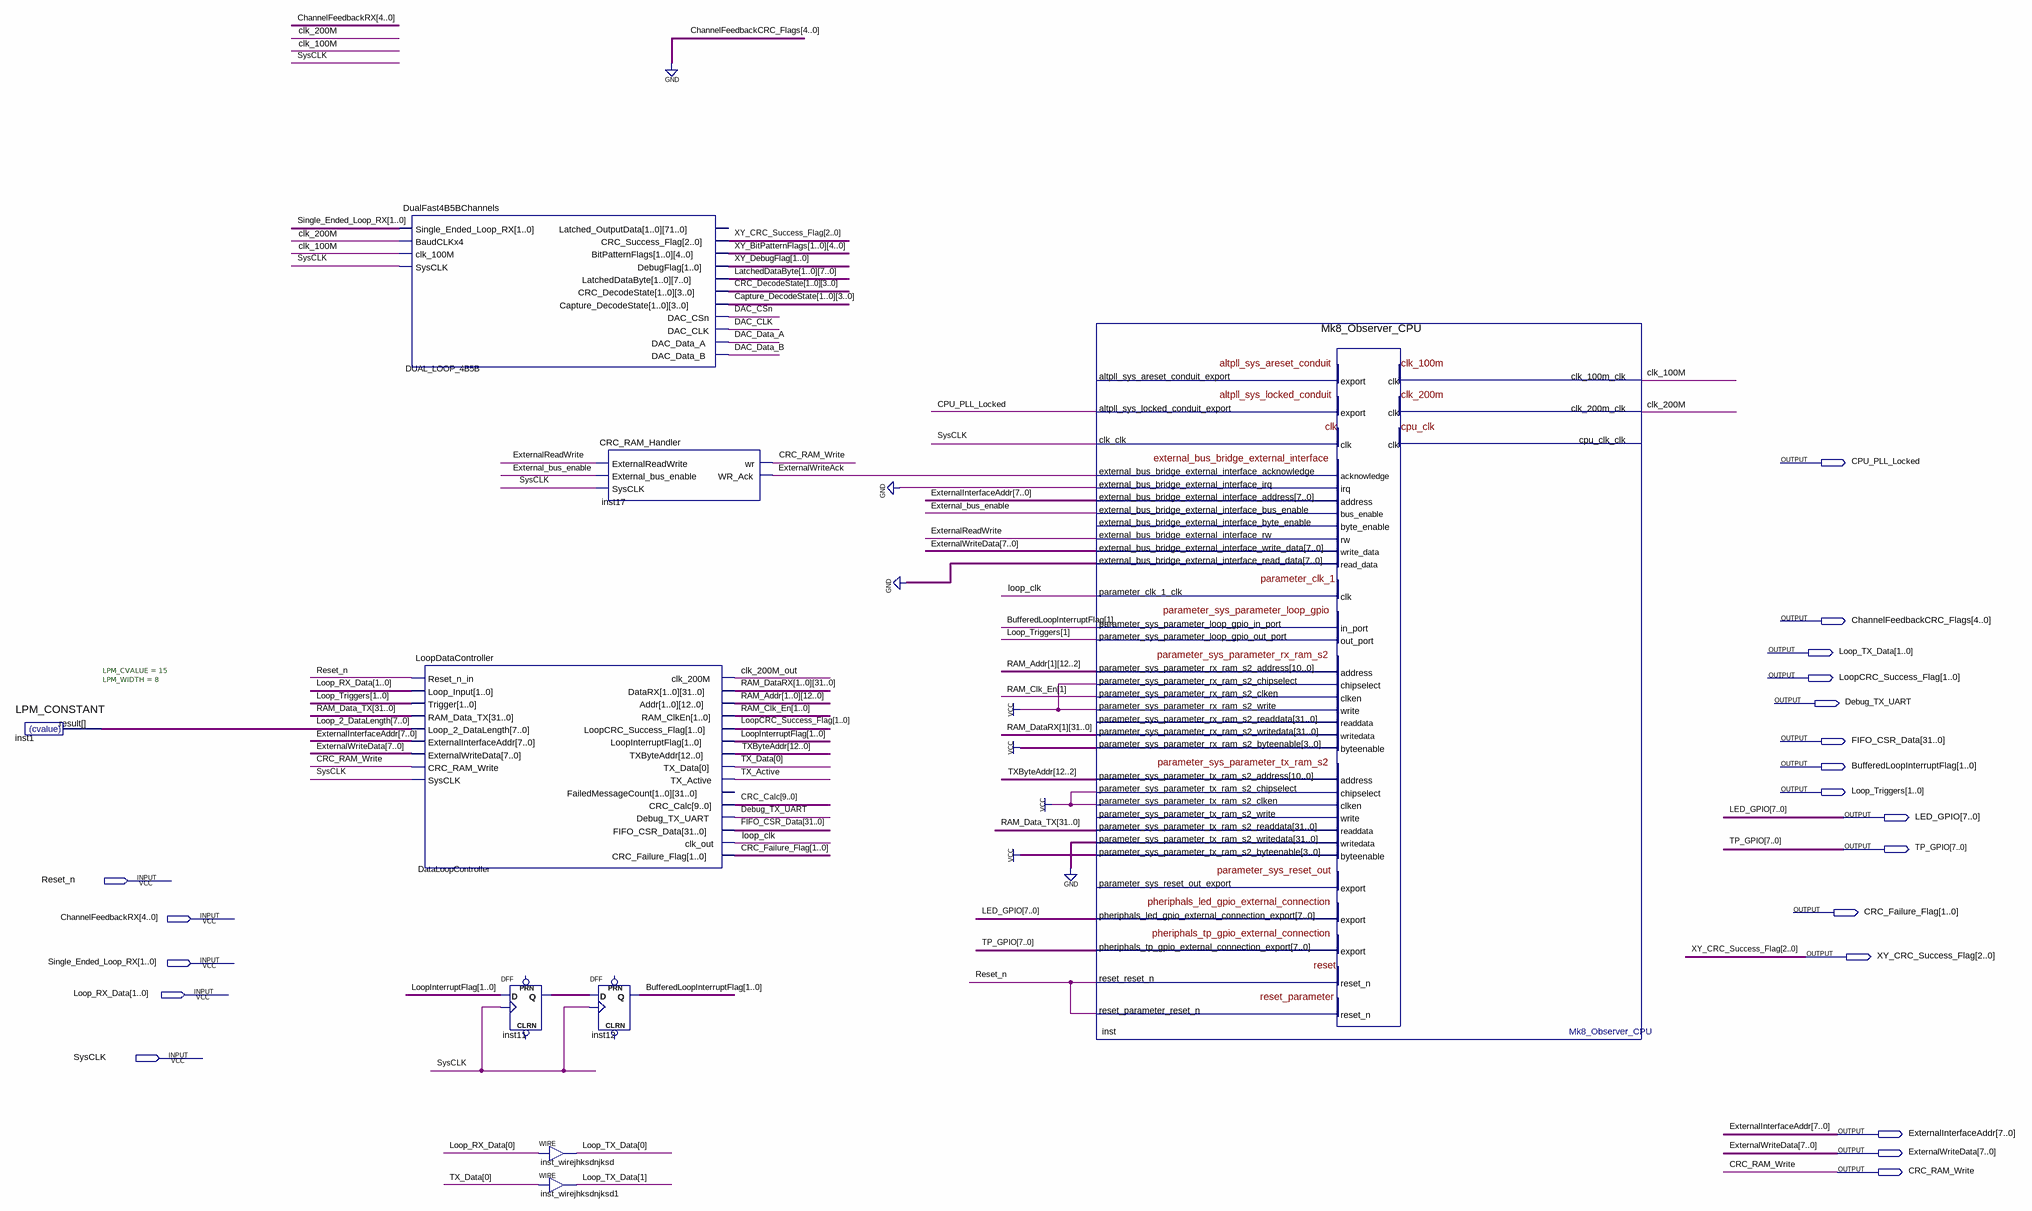
[diagram p0: schematic sheet]
// Quartus schematic CPU_Comms_Blk.bdf as structural Verilog: 9 symbols, 20 pins
module CPU_Comms_Blk (
  input  Reset_n,
  input  [4:0] ChannelFeedbackRX,
  input  [1:0] Single_Ended_Loop_RX,
  input  [1:0] Loop_RX_Data,
  input  SysCLK,
  output CPU_PLL_Locked,
  output [4:0] ChannelFeedbackCRC_Flags,
  output [1:0] Loop_TX_Data,
  output [1:0] LoopCRC_Success_Flag,
  output Debug_TX_UART,
  output [31:0] FIFO_CSR_Data,
  output [1:0] BufferedLoopInterruptFlag,
  output [1:0] Loop_Triggers,
  output [7:0] LED_GPIO,
  output [7:0] TP_GPIO,
  output [1:0] CRC_Failure_Flag,
  output [2:0] XY_CRC_Success_Flag,
  output [7:0] ExternalInterfaceAddr,
  output [7:0] ExternalWriteData,
  output CRC_RAM_Write
);

  wire clk_100M, clk_200M, clk_200M_out, DAC_CLK, DAC_CSn, DAC_Data_A, DAC_Data_B, External_bus_enable,
       ExternalReadWrite, ExternalWriteAck, loop_clk, TX_Active;
  wire [0:0] TX_Data;
  wire [1:0] inst11_q, LoopInterruptFlag, RAM_Clk_En, XY_DebugFlag;
  wire [3:0] Capture_DecodeState_0, Capture_DecodeState_1, CRC_DecodeState_0, CRC_DecodeState_1;
  wire [4:0] XY_BitPatternFlags_0, XY_BitPatternFlags_1;
  wire [7:0] LatchedDataByte_0, LatchedDataByte_1, Loop_2_DataLength;
  wire [9:0] CRC_Calc;
  wire [12:0] RAM_Addr_0, RAM_Addr_1, TXByteAddr;
  wire [31:0] RAM_Data_TX, RAM_DataRX_0, RAM_DataRX_1;

  LPM_CONSTANT #(.LPM_CVALUE(15), .LPM_WIDTH(8)) inst1 (.result(Loop_2_DataLength));
  DualFast4B5BChannels DUAL_LOOP_4B5B (
    .Single_Ended_Loop_RX(Single_Ended_Loop_RX), .BaudCLKx4(clk_200M), .clk_100M(clk_100M), .SysCLK(SysCLK),
    .CRC_Success_Flag(XY_CRC_Success_Flag), .BitPatternFlags({XY_BitPatternFlags_1, XY_BitPatternFlags_0}),
    .DebugFlag(XY_DebugFlag), .LatchedDataByte({LatchedDataByte_1, LatchedDataByte_0}),
    .CRC_DecodeState({CRC_DecodeState_1, CRC_DecodeState_0}),
    .Capture_DecodeState({Capture_DecodeState_1, Capture_DecodeState_0}), .DAC_CSn(DAC_CSn),
    .DAC_CLK(DAC_CLK), .DAC_Data_A(DAC_Data_A), .DAC_Data_B(DAC_Data_B));  // open: Latched_OutputData
  LoopDataController DataLoopController (
    .Reset_n_in(Reset_n), .Loop_Input(Loop_RX_Data), .Trigger(Loop_Triggers), .RAM_Data_TX(RAM_Data_TX),
    .Loop_2_DataLength(Loop_2_DataLength), .ExternalInterfaceAddr(ExternalInterfaceAddr),
    .ExternalWriteData(ExternalWriteData), .CRC_RAM_Write(CRC_RAM_Write), .SysCLK(SysCLK),
    .clk_200M(clk_200M_out), .DataRX({RAM_DataRX_1, RAM_DataRX_0}), .Addr({RAM_Addr_1, RAM_Addr_0}),
    .RAM_ClkEn(RAM_Clk_En), .LoopCRC_Success_Flag(LoopCRC_Success_Flag),
    .LoopInterruptFlag(LoopInterruptFlag), .TXByteAddr(TXByteAddr), .TX_Data(TX_Data[0]),
    .TX_Active(TX_Active), .CRC_Calc(CRC_Calc), .Debug_TX_UART(Debug_TX_UART), .FIFO_CSR_Data(FIFO_CSR_Data),
    .clk_out(loop_clk), .CRC_Failure_Flag(CRC_Failure_Flag));  // open: FailedMessageCount
  DFF inst11[1:0] (.CLK(SysCLK), .D(LoopInterruptFlag), .Q(inst11_q));  // open: CLRN, PRN
  assign Loop_TX_Data[0] = Loop_RX_Data[0];  // WIRE inst_wirejhksdnjksd
  assign Loop_TX_Data[1] = TX_Data[0];  // WIRE inst_wirejhksdnjksd1
  CRC_RAM_Handler inst17 (
    .ExternalReadWrite(ExternalReadWrite), .External_bus_enable(External_bus_enable), .SysCLK(SysCLK),
    .wr(CRC_RAM_Write), .WR_Ack(ExternalWriteAck));
  DFF inst12[1:0] (.CLK(SysCLK), .D(inst11_q), .Q(BufferedLoopInterruptFlag));  // open: CLRN, PRN
  Mk8_Observer_CPU inst (
    .clk_clk(SysCLK), .external_bus_bridge_external_interface_acknowledge(ExternalWriteAck),
    .external_bus_bridge_external_interface_irq(1'b0),
    .external_bus_bridge_external_interface_read_data({8{1'b0}}), .parameter_clk_1_clk(loop_clk),
    .parameter_sys_parameter_loop_gpio_in_port(BufferedLoopInterruptFlag[1]),
    .parameter_sys_parameter_rx_ram_s2_address(RAM_Addr_1[12:2]),
    .parameter_sys_parameter_rx_ram_s2_chipselect(1'b1),
    .parameter_sys_parameter_rx_ram_s2_clken(RAM_Clk_En[1]), .parameter_sys_parameter_rx_ram_s2_write(1'b1),
    .parameter_sys_parameter_rx_ram_s2_writedata(RAM_DataRX_1),
    .parameter_sys_parameter_rx_ram_s2_byteenable(4'b1111),
    .parameter_sys_parameter_tx_ram_s2_address(TXByteAddr[12:2]),
    .parameter_sys_parameter_tx_ram_s2_chipselect(1'b1), .parameter_sys_parameter_tx_ram_s2_clken(1'b1),
    .parameter_sys_parameter_tx_ram_s2_writedata({32{1'b0}}),
    .parameter_sys_parameter_tx_ram_s2_byteenable(4'b1111), .reset_reset_n(Reset_n),
    .reset_parameter_reset_n(Reset_n), .altpll_sys_locked_conduit_export(CPU_PLL_Locked),
    .clk_100m_clk(clk_100M), .clk_200m_clk(clk_200M),
    .external_bus_bridge_external_interface_address(ExternalInterfaceAddr),
    .external_bus_bridge_external_interface_bus_enable(External_bus_enable),
    .external_bus_bridge_external_interface_rw(ExternalReadWrite),
    .external_bus_bridge_external_interface_write_data(ExternalWriteData),
    .parameter_sys_parameter_loop_gpio_out_port(Loop_Triggers[1]),
    .parameter_sys_parameter_tx_ram_s2_readdata(RAM_Data_TX),
    .pheriphals_led_gpio_external_connection_export(LED_GPIO),
    .pheriphals_tp_gpio_external_connection_export(TP_GPIO));  // open: altpll_sys_areset_conduit_export, parameter_sys_parameter_tx_ram_s2_write, cpu_clk_clk, external_bus_bridge_external_interface_byte_enable, parameter_sys_parameter_rx_ram_s2_readdata, parameter_sys_reset_out_export

  assign ChannelFeedbackCRC_Flags = {5{1'b0}};
endmodule
